# EAGLE design backplate (EAGLE 9.0.0)
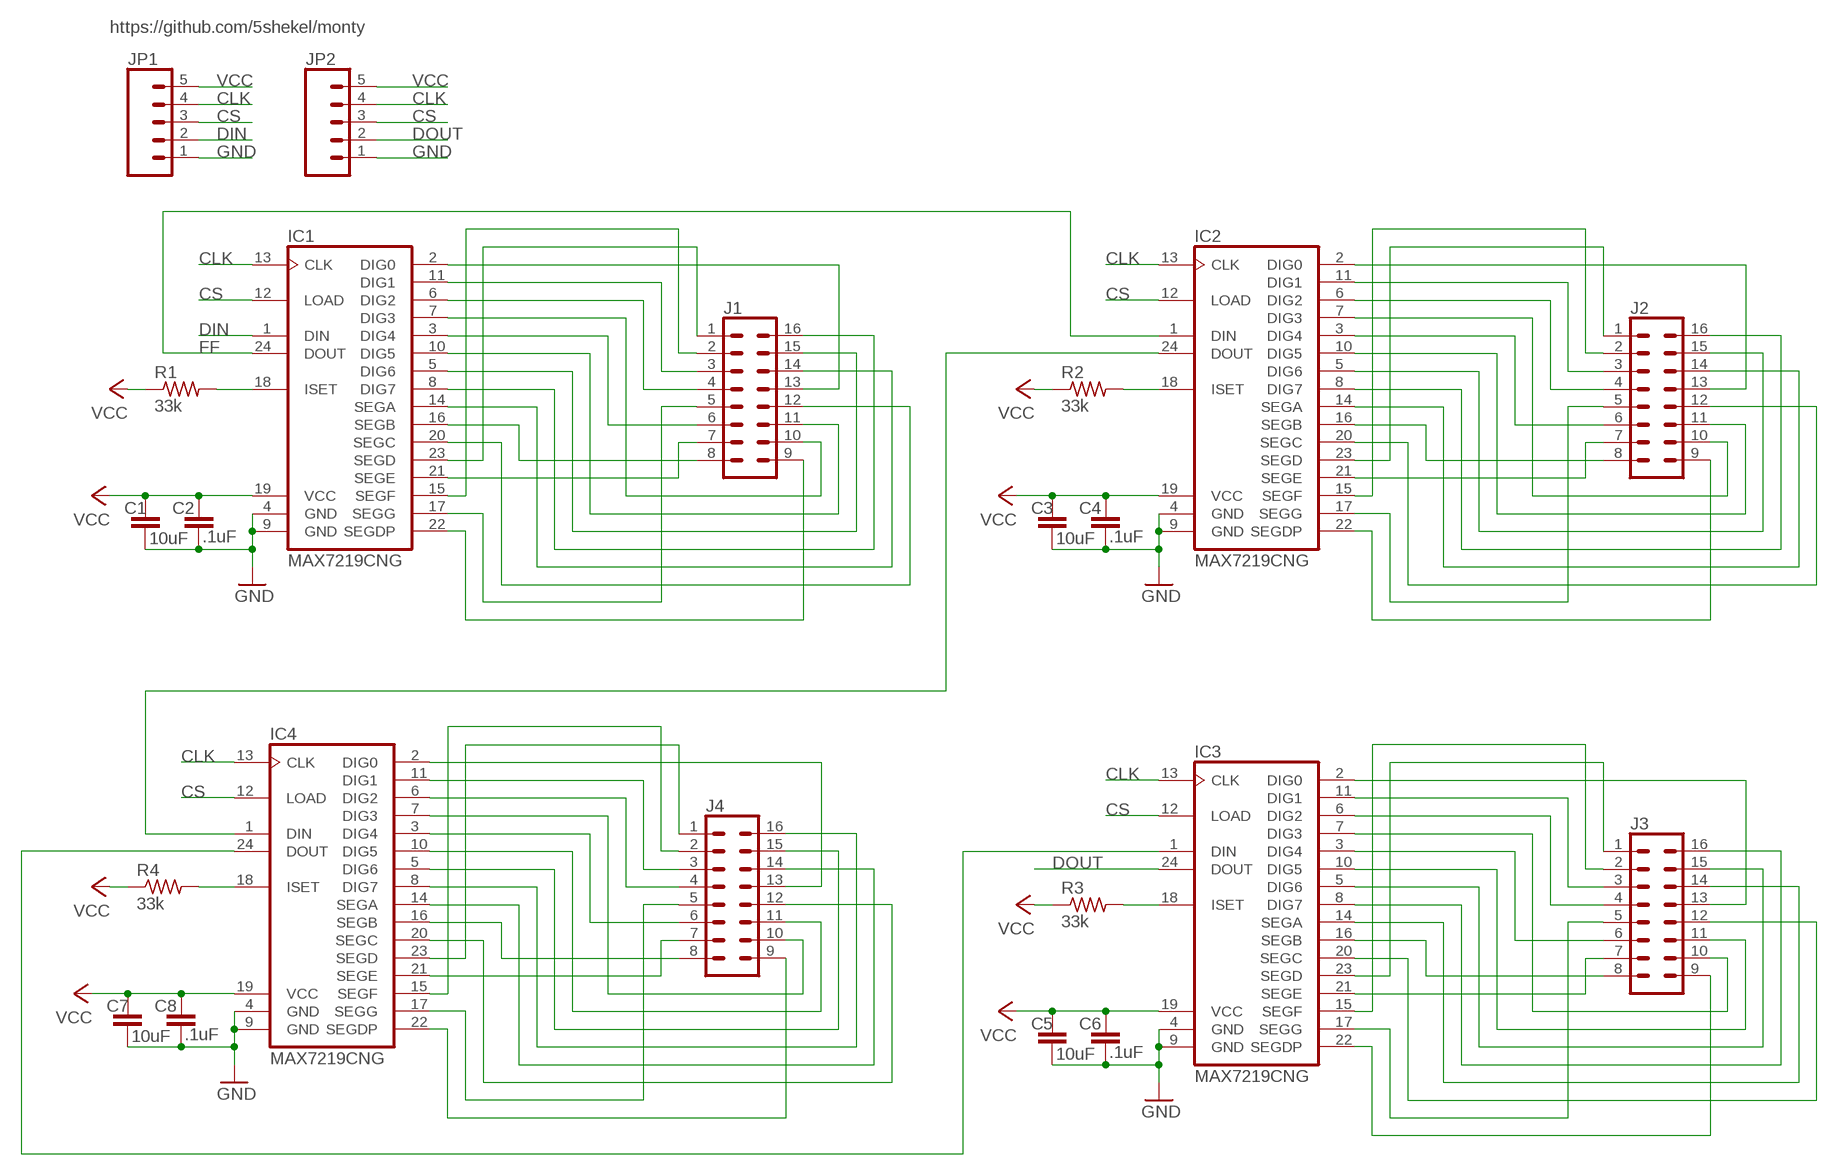
[diagram p0: schematic, sheet 1]

## Parts
C1  10uF  CAP0805  [0805]
C2  .1uF  CAP0805  [0805]
C3  10uF  CAP0805  [0805]
C4  .1uF  CAP0805  [0805]
C5  10uF  CAP0805  [0805]
C6  .1uF  CAP0805  [0805]
C7  10uF  CAP0805  [0805]
C8  .1uF  CAP0805  [0805]
IC1  MAX7219CNG  [DIL24-3]
IC2  MAX7219CNG  [DIL24-3]
IC3  MAX7219CNG  [DIL24-3]
IC4  MAX7219CNG  [DIL24-3]
J1  CONN_08X2IC  [2X8]
J2  CONN_08X2IC  [2X8]
J3  CONN_08X2IC  [2X8]
J4  CONN_08X2IC  [2X8]
JP1  CONN_05  [1X05]
JP2  CONN_05  [1X05]
R1  33k  R-US_V526-0  [V526-0]
R2  33k  R-US_V526-0  [V526-0]
R3  33k  R-US_V526-0  [V526-0]
R4  33k  R-US_V526-0  [V526-0]

## Nets
CLK: IC1.13(CLK) IC2.13(CLK) IC3.13(CLK) IC4.13(CLK) JP1.4 JP2.4
CS: IC1.12(LOAD) IC2.12(LOAD) IC3.12(LOAD) IC4.12(LOAD) JP1.3 JP2.3
DIN: IC1.1(DIN) JP1.2
DOUT: IC3.24(DOUT) JP2.2
FF: IC1.24(DOUT) IC2.1(DIN)
GND: C1.2 C2.2 C3.2 C4.2 C5.2 C6.2 C7.2 C8.2 IC1.4(GND) IC1.9(GND) IC2.4(GND) IC2.9(GND) IC3.4(GND) IC3.9(GND) IC4.4(GND) IC4.9(GND) JP1.1 JP2.1
N$1: IC1.18(ISET) R1.2
N$2: IC1.2(DIG0) J1.13
N$3: IC1.11(DIG1) J1.3
N$4: IC1.6(DIG2) J1.4
N$5: IC1.7(DIG3) J1.10
N$6: IC1.3(DIG4) J1.6
N$7: IC1.10(DIG5) J1.11
N$8: IC1.5(DIG6) J1.15
N$9: IC1.8(DIG7) J1.16
N$10: IC1.14(SEGA) J1.14
N$11: IC1.16(SEGB) J1.8
N$12: IC1.20(SEGC) J1.12
N$13: IC1.23(SEGD) J1.1
N$14: IC1.21(SEGE) J1.7
N$15: IC1.15(SEGF) J1.2
N$16: IC1.17(SEGG) J1.5
N$17: IC1.22(SEGDP) J1.9
N$18: IC2.18(ISET) R2.2
N$19: IC2.2(DIG0) J2.13
N$20: IC2.11(DIG1) J2.3
N$21: IC2.6(DIG2) J2.4
N$22: IC2.7(DIG3) J2.10
N$23: IC2.3(DIG4) J2.6
N$24: IC2.10(DIG5) J2.11
N$25: IC2.5(DIG6) J2.15
N$26: IC2.8(DIG7) J2.16
N$27: IC2.14(SEGA) J2.14
N$28: IC2.16(SEGB) J2.8
N$29: IC2.20(SEGC) J2.12
N$30: IC2.23(SEGD) J2.1
N$31: IC2.21(SEGE) J2.7
N$32: IC2.15(SEGF) J2.2
N$33: IC2.17(SEGG) J2.5
N$34: IC2.22(SEGDP) J2.9
N$35: IC3.18(ISET) R3.2
N$36: IC3.2(DIG0) J3.13
N$37: IC3.11(DIG1) J3.3
N$38: IC3.6(DIG2) J3.4
N$39: IC3.7(DIG3) J3.10
N$40: IC3.3(DIG4) J3.6
N$41: IC3.10(DIG5) J3.11
N$42: IC3.5(DIG6) J3.15
N$43: IC3.8(DIG7) J3.16
N$44: IC3.14(SEGA) J3.14
N$45: IC3.16(SEGB) J3.8
N$46: IC3.20(SEGC) J3.12
N$47: IC3.23(SEGD) J3.1
N$48: IC3.21(SEGE) J3.7
N$49: IC3.15(SEGF) J3.2
N$50: IC3.17(SEGG) J3.5
N$51: IC3.22(SEGDP) J3.9
N$52: IC4.18(ISET) R4.2
N$53: IC4.2(DIG0) J4.13
N$54: IC4.11(DIG1) J4.3
N$55: IC4.6(DIG2) J4.4
N$56: IC4.7(DIG3) J4.10
N$57: IC4.3(DIG4) J4.6
N$58: IC4.10(DIG5) J4.11
N$59: IC4.5(DIG6) J4.15
N$60: IC4.8(DIG7) J4.16
N$61: IC4.14(SEGA) J4.14
N$62: IC4.16(SEGB) J4.8
N$63: IC4.20(SEGC) J4.12
N$64: IC4.23(SEGD) J4.1
N$65: IC4.21(SEGE) J4.7
N$66: IC4.15(SEGF) J4.2
N$67: IC4.17(SEGG) J4.5
N$68: IC4.22(SEGDP) J4.9
N$69: IC2.24(DOUT) IC4.1(DIN)
N$70: IC3.1(DIN) IC4.24(DOUT)
VCC: C1.1 C2.1 C3.1 C4.1 C5.1 C6.1 C7.1 C8.1 IC1.19(VCC) IC2.19(VCC) IC3.19(VCC) IC4.19(VCC) JP1.5 JP2.5 R1.1 R2.1 R3.1 R4.1

## Notes on the sheet
- https://github.com/5shekel/monty

## Library data of the parts
C1-C8 = TinyTony_ShenzenReady:CAP: Capacitor Standard 0603 ceramic capacitor, and 0.1" leaded capacitor.
IC1-IC4 = backplate:MAX7219CNG: LED DISPLAY DRIVER; MF: MAXIM; MPN: MAX7219CNG; OC_FARNELL: 1523914; OC_NEWARK: 34C4018
J1-J4 = backplate:CONN_08X2: Multi connection point. Often used as Generic Header-pin footprint for 0.1 inch spaced/style header connections You can populate with any combo of single row headers, but if you'd like an exact match, check this: Header - 2x8 (Male, 0.1") <https://www.sparkfun.com/products/13156> (PRT-13156) On any of the 0.1 inch spaced packages, you can populate with these: Break Away Headers - Straight <https://www.sparkfun.com/products/116> (PRT-00116) Break Away Male Headers - Right Angle <https://www.sparkfun.com/products/553> (PRT-00553) Female Headers <https://www.sparkfun.com/products/115> (PRT-00115) Break Away Headers - Machine Pin <https://www.sparkfun.com/products/117> (PRT-00117) Break Away Female Headers - Swiss Machine Pin <https://www.sparkfun.com/products/743> (PRT-00743)
JP1 JP2 = backplate:CONN_05: Multi connection point. Often used as Generic Header-pin footprint for 0.1 inch spaced/style header connections On any of the 0.1 inch spaced packages, you can populate with these: Break Away Headers - Straight <https://www.sparkfun.com/products/116> (PRT-00116) Break Away Male Headers - Right Angle <https://www.sparkfun.com/products/553> (PRT-00553) Female Headers <https://www.sparkfun.com/products/115> (PRT-00115) Break Away Headers - Machine Pin <https://www.sparkfun.com/products/117> (PRT-00117) Break Away Female Headers - Swiss Machine Pin <https://www.sparkfun.com/products/743> (PRT-00743) For SCREWTERMINALS and SPRING TERMINALS visit here: Screw Terimnals on SparkFun.com <https://www.sparkfun.com/search/results?term=Screw+Terminals> (5mm/3.5mm/2.54mm spacing) This device is also useful as a general connection point to wire up your design to another part of your project. Our various solder wires solder well into these plated through hole pads. Hook-Up Wire - Assortment (Stranded, 22 AWG) <https://www.sparkfun.com/products/11375> (PRT-11375) Hook-Up Wire - Assortment (Solid Core, 22 AWG) <https://www.sparkfun.com/products/11367> (PRT-11367) View the entire wire category on our website here <https://www.sparkfun.com/categories/141> Special notes: Molex polarized connector foot print use with SKU : PRT-08231 with associated crimp pins and housings. 1MM SMD Version SKU: PRT-10208
R1-R4 = rcl:R-US_: RESISTOR, American symbol; SPICEPREFIX: R

## Board
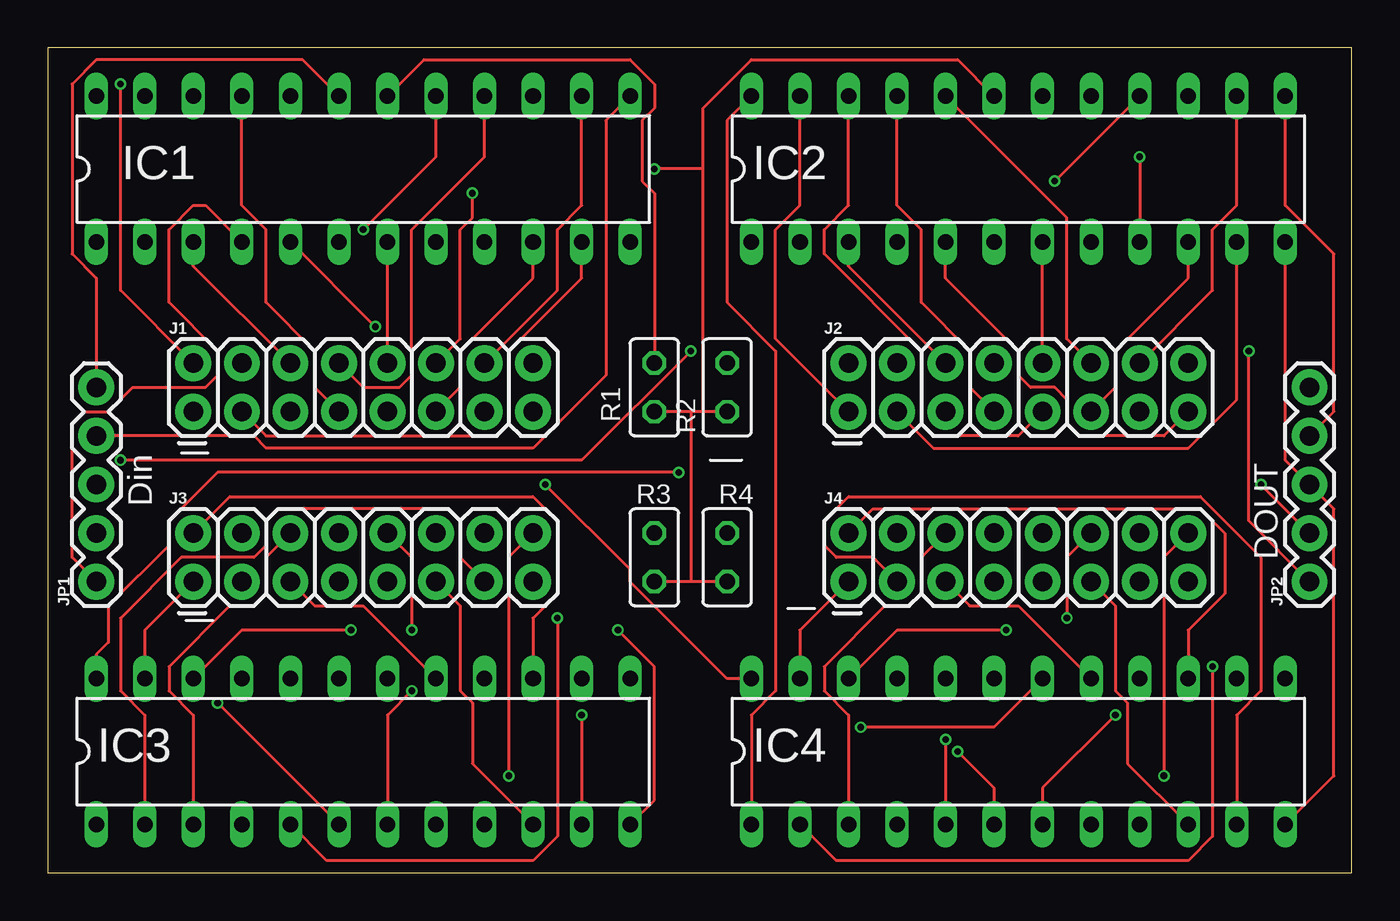
[diagram p1: board, top side]
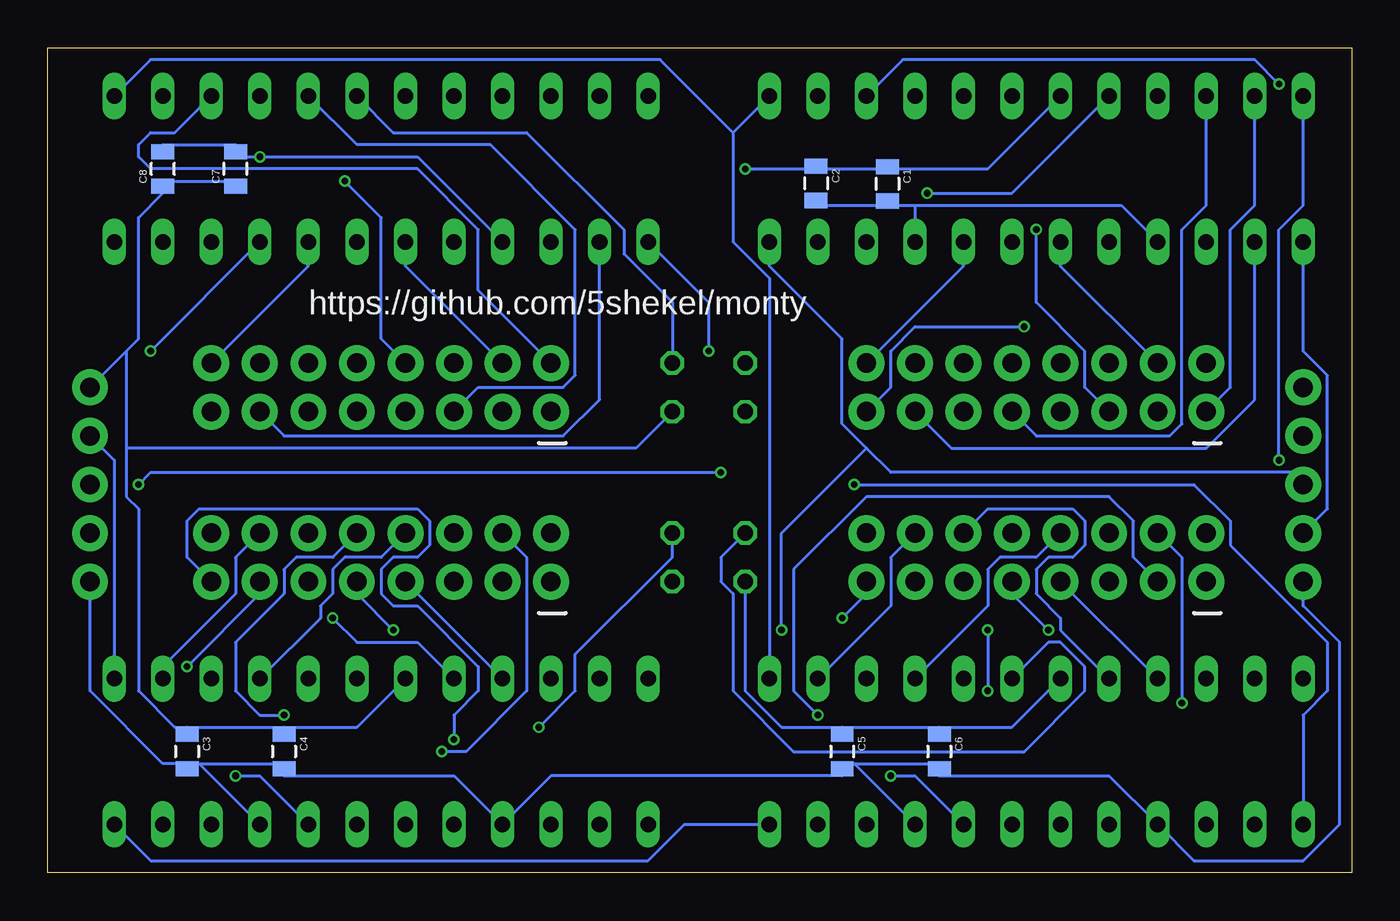
[diagram p2: board, bottom side, seen from below]

Size 68.25 x 43.17 mm. Coordinates in mm from the lower left corner, seen from the top.
Outline: 0,0 68.25,0 68.25,43.17 0,43.17 0,0
Copper layers (1*16): Top 0.018mm / dielectric 1.55mm / Bottom 0.018mm
Design rules "eC_2Layer_PClass6_BaseCopperO18_eCDefault": minimum track width 0.15mm, minimum drill 0.35mm, track to track 0.15mm, track to pad 0.15mm, pad to pad 0.15mm, via to via 0.15mm, smd to smd 0mil, copper to edge 0.25mm, drill to drill 0.35mm, minimum pad ring 0.175mm, minimum via ring 0.125mm, stop-mask expansion 0mil, vias tented up to drill 0.45mm, thermal gap 0.2mm

### Footprints (pad centres in the part's own frame; a part is rotated, then mirrored left to right if it is on the bottom)
0805 = smd 0.8 x 1.2: 1 -0.9,0; 2 0.9,0
DIL24-3 = drill 0.813 long: 1 -13.97,-3.81; 2 -11.43,-3.81; 3 -8.89,-3.81; 4 -6.35,-3.81; 5 -3.81,-3.81; 6 -1.27,-3.81; 7 1.27,-3.81; 8 3.81,-3.81; 9 6.35,-3.81; 10 8.89,-3.81; 11 11.43,-3.81; 12 13.97,-3.81; 13 13.97,3.81; 14 11.43,3.81; 15 8.89,3.81; 16 6.35,3.81; 17 3.81,3.81; 18 1.27,3.81; 19 -1.27,3.81; 20 -3.81,3.81; 21 -6.35,3.81; 22 -8.89,3.81; 23 -11.43,3.81; 24 -13.97,3.81
2X8 = drill 1.016 pad 1.88: 1 0,0; 2 0,2.54; 3 2.54,0; 4 2.54,2.54; 5 5.08,0; 6 5.08,2.54; 7 7.62,0; 8 7.62,2.54; 9 10.16,0; 10 10.16,2.54; 11 12.7,0; 12 12.7,2.54; 13 15.24,0; 14 15.24,2.54; 15 17.78,0; 16 17.78,2.54
1X05 = drill 1.016 pad 1.88: 1 0,0; 2 2.54,0; 3 5.08,0; 4 7.62,0; 5 10.16,0
V526-0 = drill 0.813 octagon: 1 -1.27,0; 2 1.27,0

### Placement (x,y rotation side)
C1  24.3,36.05 270 bottom
C2  28.03,36.08 270 bottom
C3  60.96,6.35 270 bottom
C4  55.88,6.35 270 bottom
C5  26.67,6.35 270 bottom
C6  21.59,6.35 270 bottom
C7  58.42,36.83 90 bottom
C8  62.23,36.83 90 bottom
IC1  16.51,36.83 0 top
IC2  50.8,36.83 0 top
IC3  16.51,6.35 0 top
IC4  50.8,6.35 0 top
J1  7.62,24.13 0 top
J2  41.91,24.13 0 top
J3  7.62,15.24 0 top
J4  41.91,15.24 0 top
JP1  2.54,15.24 90 top
JP2  66.04,15.24 90 top
R1  31.75,25.4 90 top
R2  35.56,25.4 90 top
R3  31.75,16.51 90 top
R4  35.56,16.51 90 top

### Tracks (layer width: path | path; a pad name or v marks a point on that pad's centre or on a via)
CLK
  Top 0.15: IC2.13 64.77,34.92 67.31,32.38 67.31,24.13 JP2.4 | JP1.4 10.79,22.86 11.43,22.23 25.4,22.23 29.21,26.04 29.21,39.37 IC1.13
  Bottom 0.15: IC4.13 64.77,21.59 JP2.4 | IC3.13 30.48,31.11 32.38,33.02 32.38,38.73 | IC1.13 32.38,38.73 | IC2.13 62.87,42.55 36.2,42.55 32.38,38.73
CS  (via drill 0.35)
  Top 0.15: IC2.12 64.77,21.59 JP2.3 67.31,19.05 67.31,5.08 IC4.12 | v29.84,12.7 31.75,10.79 31.75,3.81 IC3.12
  Bottom 0.15: IC1.12 30.48,31.75 26.67,27.94 26.67,23.5 25.4,22.23 | 25.4,22.23 24.13,20.95 3.17,20.95 JP1.3 | IC3.12 34.92,2.54 36.83,0.64 62.87,0.64 IC4.12 | 25.4,22.23 29.84,17.78 v29.84,12.7
DIN
  Bottom 0.15: IC1.1 2.54,27.3 1.27,26.04 1.27,19.05 JP1.2
DOUT  (via drill 0.35)
  Top 0.15: IC3.24 2.54,11.43 3.17,12.06 3.17,13.97 6.35,17.14 6.35,18.41 8.89,20.95 v33.02,20.95 | JP2.2 v63.5,20.32
  Bottom 0.15: v33.02,20.95 62.87,20.95 v63.5,20.32
FF  (via drill 0.35)
  Top 0.15: v3.81,21.59 27.94,21.59 v33.66,27.3
  Bottom 0.15: IC1.24 2.54,34.92 3.81,33.66 v3.81,21.59 | v33.66,27.3 33.66,29.84 IC2.1
GND  (via drill 0.35)
  Top 0.15: v57.15,37.47 IC2.9 | v62.87,27.3 62.87,18.41 JP2.1 | IC1.4 8.26,34.92 7.62,34.92 6.35,33.66 6.35,29.84 8.89,27.3 8.89,26.04 8.26,25.4 4.45,25.4 3.17,24.13 1.91,24.13 1.27,23.5 1.27,16.51 JP1.1
  Bottom 0.15: C8.2 62.23,38.1 58.42,38.1 C7.2 58.42,37.47 v57.15,37.47 48.9,37.47 IC2.4 | 60.96,5.71 60.33,5.71 | 60.33,5.71 55.88,5.71 C4.2 55.88,5.08 46.99,5.08 IC4.4 41.91,5.08 26.67,5.08 C5.2 26.67,5.71 26.04,5.71 | 60.33,5.71 IC4.9 | JP2.1 66.04,9.53 62.23,5.71 60.96,5.71 | 60.96,5.71 C3.2 | v62.87,27.3 IC2.9 | C2.2 27.94,34.92 24.77,34.92 C1.2 24.13,34.92 22.86,34.92 | IC1.4 12.06,34.92 22.86,34.92 | 22.86,34.92 IC1.9 | 26.04,5.71 21.59,5.71 C6.2 21.59,5.08 12.7,5.08 IC3.4 8.26,0.64 2.54,0.64 0.64,2.54 0.64,12.06 2.54,13.97 JP1.1 | 26.04,5.71 IC3.9
N$1
  Top 0.15: R1.2 31.75,35.56 31.11,36.2 31.11,39.37 31.75,40.01 31.75,41.27 30.48,42.55 19.68,42.55 IC1.18
N$2
  Bottom 0.15: IC1.2 5.08,24.77 7.62,22.23 20.95,22.23 J1.13
N$3
  Top 0.15: IC1.11 27.94,31.11 24.13,27.3 24.13,23.5 23.5,22.86 11.43,22.86 J1.3
N$4
  Bottom 0.15: IC1.6 15.24,31.75 J1.4
N$5
  Top 0.15: J1.10 IC1.7
N$6
  Top 0.15: IC1.3 7.62,31.75 J1.6
N$7
  Top 0.15: IC1.10 25.4,31.11 21.59,27.3 21.59,25.4 J1.11
N$8  (via drill 0.35)
  Top 0.15: v17.14,28.57 IC1.5
  Bottom 0.15: v17.14,28.57 22.86,28.57 24.13,27.3 24.13,25.4 J1.15
N$9
  Bottom 0.15: IC1.8 20.32,31.75 J1.16
N$10
  Top 0.15: IC1.14 27.94,34.92 26.67,33.66 26.67,30.48 J1.14
N$11
  Top 0.15: IC1.16 22.86,37.47 19.05,33.66 19.05,26.04 18.41,25.4 16.51,25.4 J1.8
N$12  (via drill 0.35)
  Top 0.15: v22.23,35.56 22.23,34.29 21.59,33.66 21.59,27.94 J1.12
  Bottom 0.15: IC1.20 17.78,35.56 v22.23,35.56
N$13
  Bottom 0.15: IC1.23 5.08,34.92 6.35,33.66 6.35,25.4 J1.1
N$14
  Top 0.15: IC1.21 10.16,34.92 11.43,33.66 11.43,29.84 13.97,27.3 13.97,25.4 J1.7
N$15  (via drill 0.35)
  Top 0.15: v3.81,41.27 3.81,30.48 J1.2
  Bottom 0.15: IC1.15 23.5,42.55 5.08,42.55 v3.81,41.27
N$16  (via drill 0.35)
  Top 0.15: IC1.17 20.32,37.47 v16.51,33.66
  Bottom 0.15: v16.51,33.66 16.51,29.84 13.97,27.3 13.97,25.4 J1.5
N$17
  Bottom 0.15: IC1.22 7.62,34.92 8.89,33.66 8.89,23.5 9.53,22.86 16.51,22.86 J1.9
N$18
  Bottom 0.15: R2.2 35.56,29.84 38.1,32.38 38.1,33.66 43.18,38.73 50.16,38.73 IC2.18
N$19
  Bottom 0.15: IC2.2 39.37,24.77 41.27,22.86 55.88,22.86 J2.13
N$20
  Top 0.15: IC2.11 62.23,24.77 59.69,22.23 46.35,22.23 J2.3
N$21
  Bottom 0.15: IC2.6 49.53,31.75 J2.4
N$22
  Top 0.15: J2.10 IC2.7
N$23
  Top 0.15: IC2.3 41.91,31.75 J2.6
N$24
  Top 0.15: IC2.10 59.69,31.11 55.88,27.3 55.88,25.4 J2.11
N$25
  Top 0.15: IC2.5 46.99,31.11 50.8,27.3 50.8,26.04 51.44,25.4 52.7,25.4 53.34,24.77 53.34,23.5 53.98,22.86 58.42,22.86 J2.15
N$26
  Bottom 0.15: IC2.8 54.61,31.75 J2.16
N$27
  Top 0.15: IC2.14 62.23,34.92 60.96,33.66 60.96,30.48 J2.14
N$28  (via drill 0.35)
  Top 0.15: v52.7,36.2 IC2.16
  Bottom 0.15: v52.7,36.2 50.8,34.29 50.8,27.94 J2.8
N$29
  Top 0.15: IC2.20 53.34,34.29 53.34,27.94 J2.12
N$30
  Top 0.15: IC2.23 39.37,34.92 38.1,33.66 38.1,27.94 J2.1
N$31
  Top 0.15: IC2.21 44.45,34.92 45.72,33.66 45.72,29.84 48.26,27.3 48.26,25.4 J2.7
N$32
  Bottom 0.15: IC2.15 61.59,38.73 62.87,38.73 63.5,38.1 63.5,37.47 62.87,36.83 48.9,36.83 45.72,33.66 45.72,30.48 J2.2
N$33
  Bottom 0.15: IC2.17 52.07,38.1 45.09,38.1 40.64,33.66 40.64,26.04 41.27,25.4 45.72,25.4 J2.5
N$34
  Top 0.15: IC2.22 41.91,34.92 40.64,33.66 40.64,32.38 45.72,27.3 45.72,23.5 46.35,22.86 50.8,22.86 J2.9
N$35
  Bottom 0.15: IC3.18 15.88,12.06 15.24,12.06 13.97,10.79 13.97,9.53 17.14,6.35 29.21,6.35 32.38,9.53 32.38,14.61 33.02,15.24 33.02,16.51 R3.2
N$36
  Top 0.15: IC3.2 5.08,8.26 3.81,9.53 3.81,13.34 6.99,16.51 10.79,16.51 11.43,17.14 11.43,18.41 12.06,19.05 20.95,19.05 21.59,18.41 21.59,16.51 J3.13
N$37  (via drill 0.35)
  Top 0.15: v27.94,8.26 IC3.11
  Bottom 0.15: v27.94,8.26 29.21,9.53 29.21,15.88 25.4,19.68 12.7,19.68 11.43,18.41 11.43,16.51 J3.3
N$38  (via drill 0.35)
  Top 0.15: v8.89,8.89 IC3.6
  Bottom 0.15: v8.89,8.89 8.89,16.51 J3.4
N$39  (via drill 0.35)
  Top 0.15: IC3.7 17.78,8.26 v19.05,9.53 | v19.05,12.7 19.05,16.51 J3.10
  Bottom 0.15: v19.05,12.7 v19.05,9.53
N$40
  Top 0.15: IC3.3 7.62,8.26 6.35,9.53 6.35,10.79 9.53,13.97 10.79,13.97 11.43,14.61 11.43,16.51 J3.6
N$41
  Top 0.15: IC3.10 22.23,5.71 22.23,8.89 21.59,9.53 21.59,13.97 J3.11
N$42  (via drill 0.35)
  Top 0.15: IC3.5 14.61,0.64 25.4,0.64 26.67,1.91 v26.67,13.34
  Bottom 0.15: v26.67,13.34 25.4,14.61 J3.15
N$43  (via drill 0.35)
  Top 0.15: v24.13,5.08 24.13,16.51 J3.16
  Bottom 0.15: IC3.8 22.86,5.08 v24.13,5.08
N$44
  Bottom 0.15: IC3.14 24.13,13.97 24.13,16.51 J3.14
N$45
  Bottom 0.15: IC3.16 19.05,13.97 19.05,15.88 18.41,16.51 16.51,16.51 J3.8
N$46
  Bottom 0.15: IC3.20 15.24,12.7 15.24,13.34 16.51,14.61 16.51,15.88 15.88,16.51 14.61,16.51 13.97,17.14 13.97,18.41 14.61,19.05 19.05,19.05 J3.12
N$47
  Top 0.15: IC3.23 5.08,12.7 J3.1
N$48
  Bottom 0.15: J3.7 IC3.21
N$49
  Top 0.15: IC3.15 25.4,13.34 26.67,14.61 26.67,18.41 25.4,19.68 9.53,19.68 J3.2
N$50
  Top 0.15: IC3.17 16.51,13.97 13.97,13.97 J3.5
N$51  (via drill 0.35)
  Top 0.15: IC3.22 10.16,12.7 v15.88,12.7
  Bottom 0.15: v15.88,12.7 17.78,14.61 J3.9
N$52  (via drill 0.35)
  Top 0.15: v42.55,7.62 49.53,7.62 IC4.18
  Bottom 0.15: R4.2 35.56,16.51 40.64,11.43 40.64,9.53 v42.55,7.62
N$53  (via drill 0.35)
  Top 0.15: IC4.2 41.27,0.64 59.69,0.64 60.96,1.91 v60.96,10.79
  Bottom 0.15: v60.96,10.79 57.15,14.61 J4.13
N$54
  Top 0.15: IC4.11 62.23,8.26 63.5,9.53 63.5,16.51 60.33,19.68 41.91,19.68 40.64,18.41 40.64,17.14 41.27,16.51 43.18,16.51 J4.3
N$55  (via drill 0.35)
  Top 0.15: IC4.6 49.53,4.45 v47.62,6.35
  Bottom 0.15: v47.62,6.35 46.35,6.35 43.18,9.53 43.18,16.51 J4.4
N$56  (via drill 0.35)
  Top 0.15: IC4.7 52.07,4.45 v55.88,8.26
  Bottom 0.15: v55.88,8.26 57.15,8.26 58.42,9.53 58.42,12.06 55.88,14.61 55.88,15.88 55.24,16.51 53.34,16.51 J4.10
N$57
  Top 0.15: IC4.3 41.91,8.26 40.64,9.53 40.64,10.79 43.81,13.97 45.09,13.97 45.72,14.61 45.72,16.51 J4.6
N$58
  Top 0.15: IC4.10 56.52,5.71 56.52,8.89 55.88,9.53 55.88,13.97 J4.11
N$59  (via drill 0.35)
  Top 0.15: v46.99,6.99 IC4.5
  Bottom 0.15: v46.99,6.99 46.99,8.26 45.72,9.53 45.72,10.79 48.9,13.97 50.16,13.97 50.8,14.61 50.8,15.88 50.16,16.51 48.9,16.51 48.26,17.14 48.26,18.41 48.9,19.05 60.33,19.05 60.96,18.41 60.96,16.51 J4.15
N$60  (via drill 0.35)
  Top 0.15: v58.42,5.08 58.42,16.51 J4.16
  Bottom 0.15: IC4.8 57.15,5.08 v58.42,5.08
N$61
  Bottom 0.15: IC4.14 62.23,10.79 58.42,14.61 58.42,16.51 J4.14
N$62
  Bottom 0.15: IC4.16 53.98,13.34 53.98,13.97 53.34,14.61 53.34,15.88 52.7,16.51 50.8,16.51 J4.8
N$63  (via drill 0.35)
  Top 0.15: v53.34,13.34 53.34,16.51 J4.12
  Bottom 0.15: IC4.20 48.9,12.06 52.07,12.06 v53.34,13.34
N$64
  Top 0.15: IC4.23 39.37,12.7 J4.1
N$65
  Bottom 0.15: J4.7 IC4.21
N$66
  Top 0.15: IC4.15 59.69,12.7 61.59,14.61 61.59,17.78 60.33,19.05 43.18,19.05 J4.2
N$67
  Top 0.15: IC4.17 50.8,13.97 48.26,13.97 J4.5
N$68  (via drill 0.35)
  Top 0.15: IC4.22 44.45,12.7 v50.16,12.7
  Bottom 0.15: v50.16,12.7 52.07,14.61 J4.9
N$69
  Top 0.15: IC4.1 36.83,8.26 38.1,9.53 38.1,27.3 35.56,29.84 35.56,39.37 IC2.24
N$70  (via drill 0.35)
  Top 0.15: v26.04,20.32 30.48,15.88 30.48,15.24 35.56,10.16 IC4.24
  Bottom 0.15: IC3.1 2.54,8.26 1.27,9.53 1.27,12.06 6.35,17.14 6.35,18.41 8.26,20.32 v26.04,20.32
VCC  (via drill 0.35)
  Top 0.15: JP1.5 2.54,31.11 1.27,32.38 1.27,41.27 2.54,42.55 13.34,42.55 IC1.19 | R4.1 33.66,15.24 | 33.66,15.24 R3.1 | R2.1 34.29,24.13 | 34.29,24.13 33.66,24.13 | 33.66,24.13 R1.1 | IC2.19 47.62,42.55 36.83,42.55 34.29,40.01 34.29,36.83 | 34.29,24.13 34.29,36.83 | 33.66,24.13 33.66,15.24 | 34.29,36.83 v31.75,36.83
  Bottom 0.15: 60.96,7.62 55.88,7.62 | IC4.19 52.07,7.62 55.88,7.62 | 55.88,7.62 C4.1 | C7.1 58.42,36.2 62.23,36.2 C8.1 62.23,35.56 63.5,34.29 63.5,27.94 64.14,27.3 | JP2.5 64.14,27.3 | 60.96,7.62 61.59,7.62 63.5,9.53 63.5,19.05 64.14,19.68 64.14,22.23 | 64.14,27.3 64.14,22.23 | 60.96,7.62 C3.1 | IC1.19 19.05,36.83 24.13,36.83 C1.1 24.77,36.83 27.94,36.83 C2.1 28.57,36.83 v31.75,36.83 | 26.67,7.62 21.59,7.62 | IC3.19 17.78,7.62 21.59,7.62 | 21.59,7.62 C6.1 | 26.67,7.62 29.84,7.62 31.75,9.53 R3.1 | 26.67,7.62 C5.1 | 64.14,22.23 37.47,22.23 R2.1

### Text on the board
bPlace: https://github.com/5shekel/monty
tNames: DOUT | Din